# EAGLE schematic PMTHead (EAGLE 7.7.0)

## Sheet 1 of 4: PIC Processor
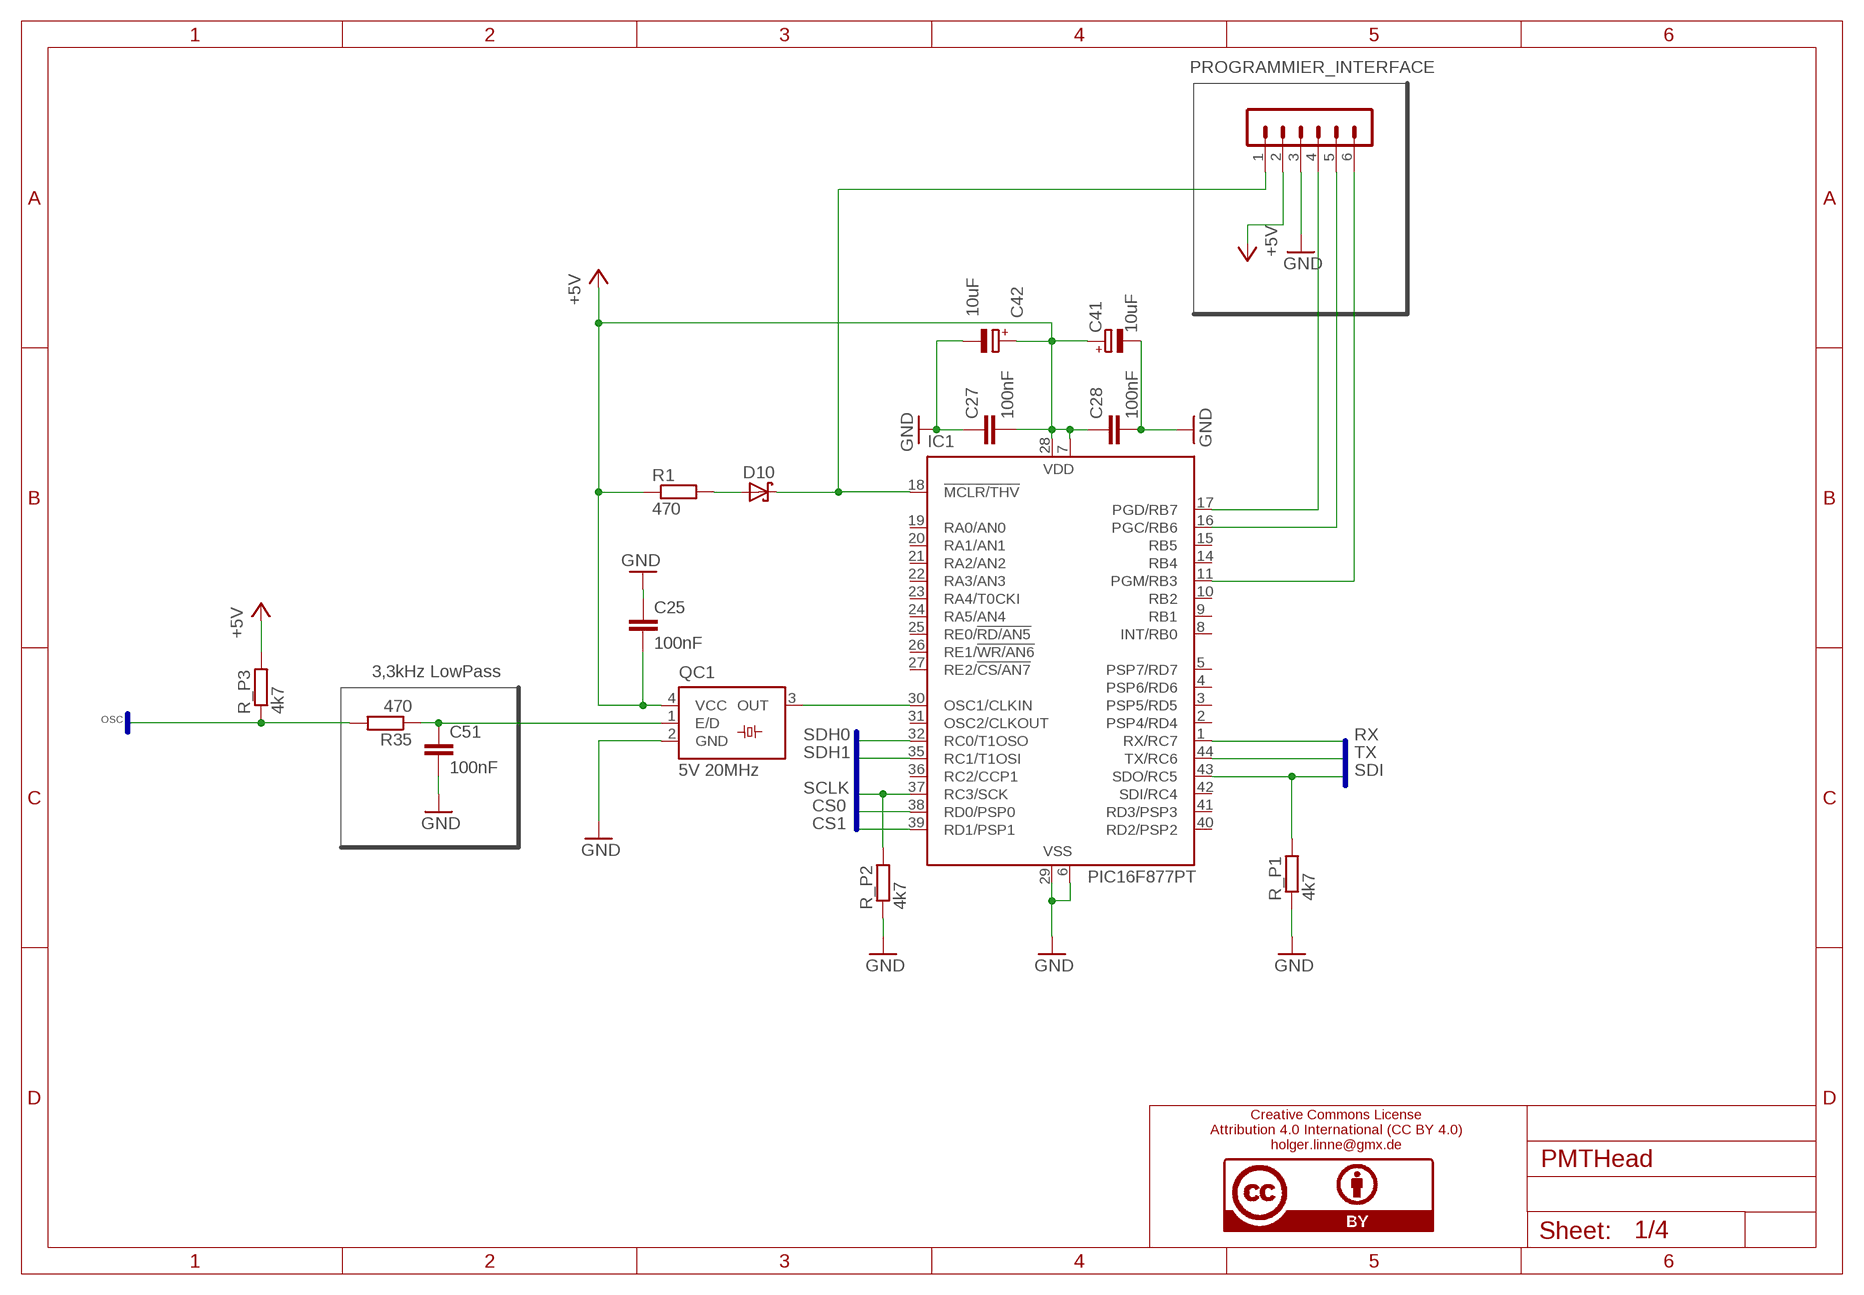
[diagram p0: schematic, sheet 1]

### Parts
C25  100nF  C-EUC0805  [C0805]
C27  100nF  C-EUC0805  [C0805]
C28  100nF  C-EUC0805  [C0805]
C41  10uF  CPOL-EUC/6032-28R  [C/6032-28R]
C42  10uF  CPOL-EUC/6032-28R  [C/6032-28R]
C51  100nF  C-EUC0805  [C0805]
D10  DIODE_BAT750  [SOT23]
IC1  PIC16F877PT  [TQFP44]
PROGRAMMIER_INTERFACE  MA06-1  [MA06-1]
QC1  5V 20MHz  SM77H  [SM77H]
R1  470  R-EU_R0805  [R0805]
R35  470  R-EU_R0805  [R0805]
R_P1  4k7  R-EU_R0805  [R0805]
R_P2  4k7  R-EU_R0805  [R0805]
R_P3  4k7  R-EU_R0805  [R0805]

### Nets
+5V: C25.2 C27.2 C28.1 C41.+ C42.+ IC1.7(VDD) IC1.28(VDD) PROGRAMMIER_INTERFACE.2 QC1.4(VCC) R1.1 R_P3.2 ; also sheet 2,4
CS0: IC1.38(RD0/PSP0) ; also sheet 2
CS1: IC1.39(RD1/PSP1) ; also sheet 2
GND: C25.1 C27.1 C28.2 C41.- C42.- C51.2 IC1.6(VSS) IC1.29(VSS) PROGRAMMIER_INTERFACE.3 QC1.2(GND) R_P1.1 R_P2.1 ; also sheet 2,3,4
N$4: IC1.11(PGM/RB3) PROGRAMMIER_INTERFACE.6
N$5: IC1.16(PGC/RB6) PROGRAMMIER_INTERFACE.5
N$6: IC1.17(PGD/RB7) PROGRAMMIER_INTERFACE.4
N$7: D10.3(C) IC1.18(!MCLR/THV) PROGRAMMIER_INTERFACE.1
N$12: D10.1(A) R1.2
N$29: C51.1 QC1.1(E/D) R35.1
OSC: R35.2 R_P3.1 ; also sheet 3
OSC_OUT: IC1.30(OSC1/CLKIN) QC1.3(OUT)
RX: IC1.1(RX/RC7) ; also sheet 3
SCLK: IC1.37(RC3/SCK) R_P2.2 ; also sheet 2
SDH0: IC1.32(RC0/T1OSO) ; also sheet 2
SDH1: IC1.35(RC1/T1OSI) ; also sheet 2
SDI: IC1.43(SDO/RC5) R_P1.2 ; also sheet 2
TX: IC1.44(TX/RC6) ; also sheet 3
Unconnected: IC1.2(PSP4/RD4) IC1.3(PSP5/RD5) IC1.4(PSP6/RD6) IC1.5(PSP7/RD7) IC1.8(INT/RB0) IC1.9(RB1) IC1.10(RB2) IC1.14(RB4) IC1.15(RB5) IC1.19(RA0/AN0) IC1.20(RA1/AN1) IC1.21(RA2/AN2) IC1.22(RA3/AN3) IC1.23(RA4/T0CKI) IC1.24(RA5/AN4) IC1.25(RE0/!RD/AN5) IC1.26(RE1/!WR/AN6) IC1.27(RE2/!CS/AN7) IC1.31(OSC2/CLKOUT) IC1.36(RC2/CCP1) IC1.40(RD2/PSP2) IC1.41(RD3/PSP3) IC1.42(SDI/RC4)

### Buses
TX,RX,OSC,SDI,SCLK,CS0,CS1,SDH0,SDH1

### Notes on the sheet
- 3,3kHz LowPass
- Creative Commons License
  Attribution 4.0 International (CC BY 4.0)
  holger.linne@gmx.de
- /Users/hll/bypig.bmp

## Sheet 2 of 4: Control PWR
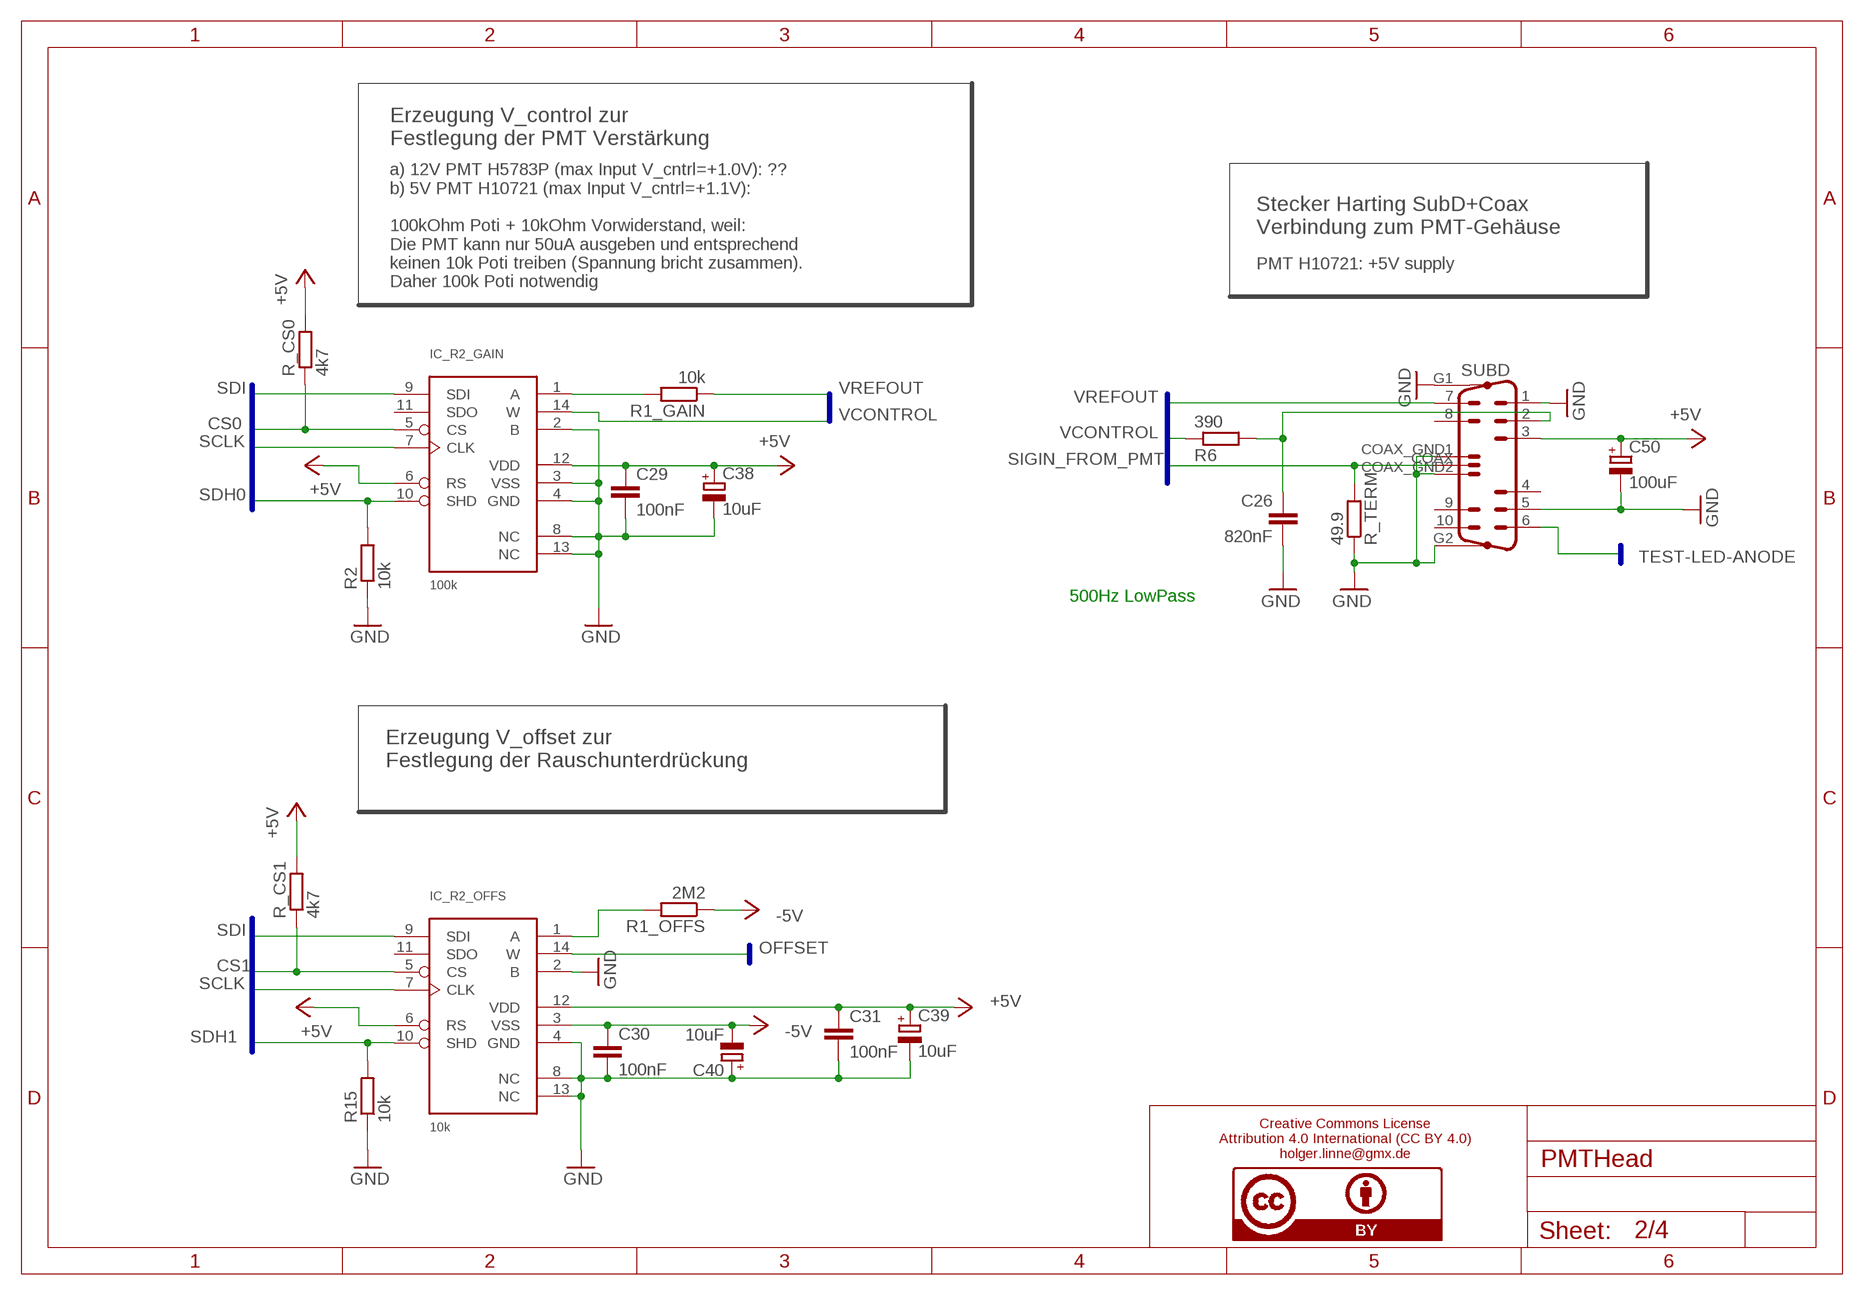
[diagram p1: schematic, sheet 2]

### Parts
C26  820nF  C-EUC1206  [C1206]
C29  100nF  C-EUC0805  [C0805]
C30  100nF  C-EUC0805  [C0805]
C31  100nF  C-EUC0805  [C0805]
C38  10uF  CPOL-EUC/6032-28R  [C/6032-28R]
C39  10uF  CPOL-EUC/6032-28R  [C/6032-28R]
C40  10uF  CPOL-EUC/6032-28R  [C/6032-28R]
C50  100uF  CPOL-EUD/7343-31R  [D/7343-31R]
IC_R2_GAIN  100k  AD7376  [TSSOP14]
IC_R2_OFFS  10k  AD7376  [TSSOP14]
R1_GAIN  10k  R-EU_R0805  [R0805]
R1_OFFS  2M2  R-EU_R0805  [R0805]
R2  10k  R-EU_R0805  [R0805]
R6  390  R-EU_R0805  [R0805]
R15  10k  R-EU_R0805  [R0805]
R_CS0  4k7  R-EU_R0805  [R0805]
R_CS1  4k7  R-EU_R0805  [R0805]
R_TERM  49.9  R-EU_R0805  [R0805]
SUBD  M15HP  [M15HP]

### Nets
+5V: C29.1 C31.1 C38.+ C39.+ C50.+ IC_R2_GAIN.6(RS) IC_R2_GAIN.12(VDD) IC_R2_OFFS.6(RS) IC_R2_OFFS.12(VDD) R_CS0.2 R_CS1.2 SUBD.3 ; also sheet 1,4
-5V: C30.1 C40.- IC_R2_OFFS.3(VSS) R1_OFFS.1 ; also sheet 4
CS0: IC_R2_GAIN.5(CS) R_CS0.1 ; also sheet 1
CS1: IC_R2_OFFS.5(CS) R_CS1.1 ; also sheet 1
GND: C26.2 C29.2 C30.2 C31.2 C38.- C39.- C40.+ C50.- IC_R2_GAIN.2(B) IC_R2_GAIN.3(VSS) IC_R2_GAIN.4(GND) IC_R2_GAIN.8(NC) IC_R2_GAIN.13(NC) IC_R2_OFFS.2(B) IC_R2_OFFS.4(GND) IC_R2_OFFS.8(NC) IC_R2_OFFS.13(NC) R2.1 R15.1 R_TERM.1 SUBD.1 SUBD.5 SUBD.COAX_GND1 SUBD.COAX_GND2 SUBD.G1 SUBD.G2 ; also sheet 1,3,4
N$11: IC_R2_GAIN.1(A) R1_GAIN.2
N$20: IC_R2_OFFS.1(A) R1_OFFS.2
N$24: C26.1 R6.2 SUBD.2
OFFSET: IC_R2_OFFS.14(W) ; also sheet 3
SCLK: IC_R2_GAIN.7(CLK) IC_R2_OFFS.7(CLK) ; also sheet 1
SDH0: IC_R2_GAIN.10(SHD) R2.2 ; also sheet 1
SDH1: IC_R2_OFFS.10(SHD) R15.2 ; also sheet 1
SDI: IC_R2_GAIN.9(SDI) IC_R2_OFFS.9(SDI) ; also sheet 1
SIGIN_FROM_PMT: R_TERM.2 SUBD.COAX ; also sheet 3
TEST-LED-ANODE: SUBD.6 ; also sheet 3
VCONTROL: IC_R2_GAIN.14(W) R6.1
VREFOUT: R1_GAIN.1 SUBD.7
Unconnected: IC_R2_GAIN.11(SDO) IC_R2_OFFS.11(SDO) SUBD.4 SUBD.8 SUBD.9 SUBD.10

### Buses
SIGIN_FROM_PMT,VREFOUT,VCONTROL,OFFSET,TEST-LED-ANODE,5V,GND
TX,RX,OSC,SDI,SCLK,CS0,CS1,SDH0,SDH1

### Notes on the sheet
- Erzeugung V_control zur
  Festlegung der PMT Verstärkung
- Stecker Harting SubD+Coax
  Verbindung zum PMT-Gehäuse
- PMT H10721: +5V supply
- a) 12V PMT H5783P (max Input V_cntrl=+1.0V): ??
  b) 5V PMT H10721 (max Input V_cntrl=+1.1V):
  
  100kOhm Poti + 10kOhm Vorwiderstand, weil: 
  Die PMT kann nur 50uA ausgeben und entsprechend
  keinen 10k Poti treiben (Spannung bricht zusammen).
  Daher 100k Poti notwendig
- 500Hz LowPass
- Erzeugung V_offset zur
  Festlegung der Rauschunterdrückung
- Creative Commons License
  Attribution 4.0 International (CC BY 4.0)
  holger.linne@gmx.de
- /Users/hll/bypig.bmp

## Sheet 3 of 4: A/D conversion and system connection
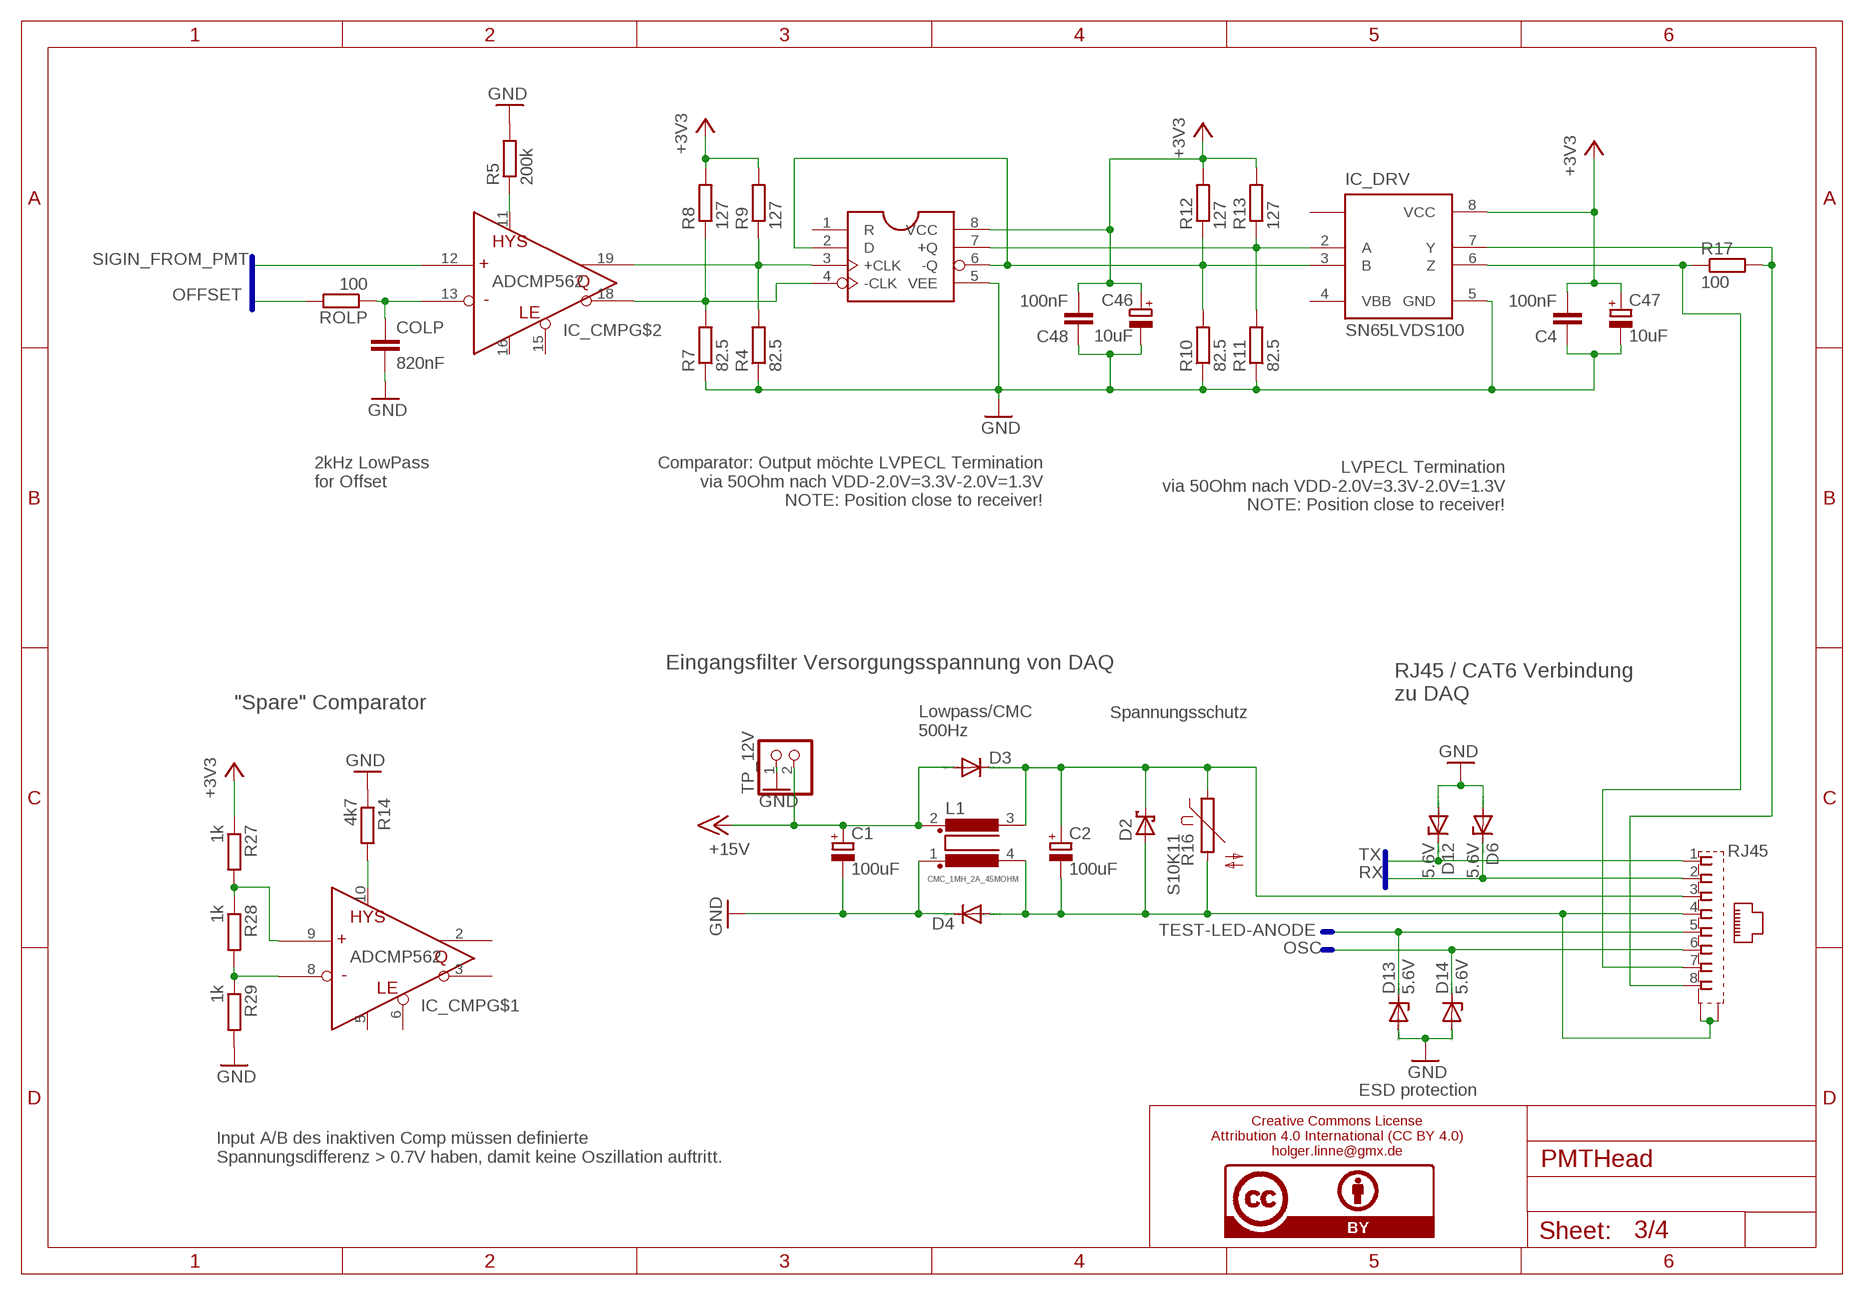
[diagram p2: schematic, sheet 3]

### Parts
C1  100uF  CPOL-EUD/7343-31R  [D/7343-31R]
C2  100uF  CPOL-EUD/7343-31R  [D/7343-31R]
C4  100nF  C-EUC0805  [C0805]
C46  10uF  CPOL-EUC/6032-28R  [C/6032-28R]
C47  10uF  CPOL-EUC/6032-28R  [C/6032-28R]
C48  100nF  C-EUC0805  [C0805]
COLP  820nF  C-EUC1206  [C1206]
D2  SCHOTTKY-DIODESMC  [SMC]
D3  DIODE-SOD80C  [SOD80C]
D4  DIODE-SOD80C  [SOD80C]
D6  5.6V  ZENER-DIODEMINIMELF  [MINIMELF]
D12  5.6V  ZENER-DIODEMINIMELF  [MINIMELF]
D13  5.6V  ZENER-DIODEMINIMELF  [MINIMELF]
D14  5.6V  ZENER-DIODEMINIMELF  [MINIMELF]
IC_CMP  ADCMP562  [QSOP20]
IC_DRV  SN65LVDS100  SN65LVDS100D  [SOP08@1]
IC_FLIP  MC100LVEL51  [SOP08@1]
L1  CMC_1MH_2A_45MOHM  [82721K]
R4  82.5  R-EU_R0805  [R0805]
R5  200k  R-EU_R0805  [R0805]
R7  82.5  R-EU_R0805  [R0805]
R8  127  R-EU_R0805  [R0805]
R9  127  R-EU_R0805  [R0805]
R10  82.5  R-EU_R0805  [R0805]
R11  82.5  R-EU_R0805  [R0805]
R12  127  R-EU_R0805  [R0805]
R13  127  R-EU_R0805  [R0805]
R14  4k7  R-EU_R0805  [R0805]
R16  S10K11  [S10K11]
R17  100  R-EU_R0805  [R0805]
R27  1k  R-EU_M0805  [M0805]
R28  1k  R-EU_M0805  [M0805]
R29  1k  R-EU_M0805  [M0805]
RJ45  CAT6  [CAT6]
ROLP  100  R-EU_R0805  [R0805]
TP_12V  PINHD-1X2  [1X02]

### Nets
12V_VON_DAQ: C2.+ D2.C D3.C L1.3 R16.1 RJ45.3
+3V3: C4.2 C46.+ C47.+ C48.2 IC_DRV.8(VCC) IC_FLIP.8(VCC) R8.2 R9.2 R12.2 R13.2 R27.1 ; also sheet 4
+15V: C1.+ D3.A L1.2 TP_12V.2 ; also sheet 4
CMP_OUT1: IC_CMP.19(+OUT) IC_FLIP.3(+CLK) R4.2 R9.1
CMP_OUT2: IC_CMP.18(-OUT) IC_FLIP.4(-CLK) R7.2 R8.1
DRIVER_OUT1: IC_DRV.7(Y) R17.2 RJ45.8
DRIVER_OUT2: IC_DRV.6(Z) R17.1 RJ45.7
FLIPFLOP_OUT1: IC_DRV.3(B) IC_FLIP.2(D) IC_FLIP.6(-Q) R10.2 R12.1
FLIPFLOP_OUT2: IC_DRV.2(A) IC_FLIP.7(+Q) R11.2 R13.1
GND: C1.- C4.1 C46.- C47.- C48.1 COLP.2 D4.C D6.A D12.A D13.A D14.A IC_DRV.5(GND) IC_FLIP.5(VEE) L1.1 R4.1 R5.2 R7.1 R10.1 R11.1 R14.1 R29.2 TP_12V.1 ; also sheet 1,2,4
GND_VON_DAQ: C2.- D2.A D4.A L1.4 R16.2 RJ45.4 RJ45.P$1(S1) RJ45.P$2(S2)
N$18: IC_CMP.11(HYS) R5.1
N$23: COLP.1 IC_CMP.13(-IN) ROLP.1
N$25: IC_CMP.10(HYS) R14.2
N$26: IC_CMP.9(+IN) R27.2 R28.1
N$27: IC_CMP.8(-IN) R28.2 R29.1
OFFSET: ROLP.2 ; also sheet 2
OSC: D14.C RJ45.6 ; also sheet 1
RX: D6.C RJ45.2 ; also sheet 1
SIGIN_FROM_PMT: IC_CMP.12(+IN) ; also sheet 2
TEST-LED-ANODE: D13.C RJ45.5 ; also sheet 2
TX: D12.C RJ45.1 ; also sheet 1
Unconnected: IC_CMP.2(+OUT) IC_CMP.3(-OUT) IC_CMP.5(+LE) IC_CMP.6(-LE) IC_CMP.15(-LE) IC_CMP.16(+LE) IC_DRV.1 IC_FLIP.1(R)

### Buses
SIGIN_FROM_PMT,VREFOUT,VCONTROL,OFFSET,TEST-LED-ANODE,5V,GND
TX,RX,OSC,SDI,SCLK,CS0,CS1,SDH0,SDH1

### Notes on the sheet
- Comparator: Output möchte LVPECL Termination
  via 50Ohm nach VDD-2.0V=3.3V-2.0V=1.3V
  NOTE: Position close to receiver!
- LVPECL Termination
  via 50Ohm nach VDD-2.0V=3.3V-2.0V=1.3V
  NOTE: Position close to receiver!
- 2kHz LowPass
  for Offset
- Eingangsfilter Versorgungsspannung von DAQ
- RJ45 / CAT6 Verbindung
  zu DAQ
- "Spare" Comparator
- Spannungsschutz
- Lowpass/CMC
  500Hz
- ESD protection
- Creative Commons License
  Attribution 4.0 International (CC BY 4.0)
  holger.linne@gmx.de
- Input A/B des inaktiven Comp müssen definierte 
  Spannungsdifferenz > 0.7V haben, damit keine Oszillation auftritt.
- /Users/hll/bypig.bmp

## Sheet 4 of 4: Powersupplies
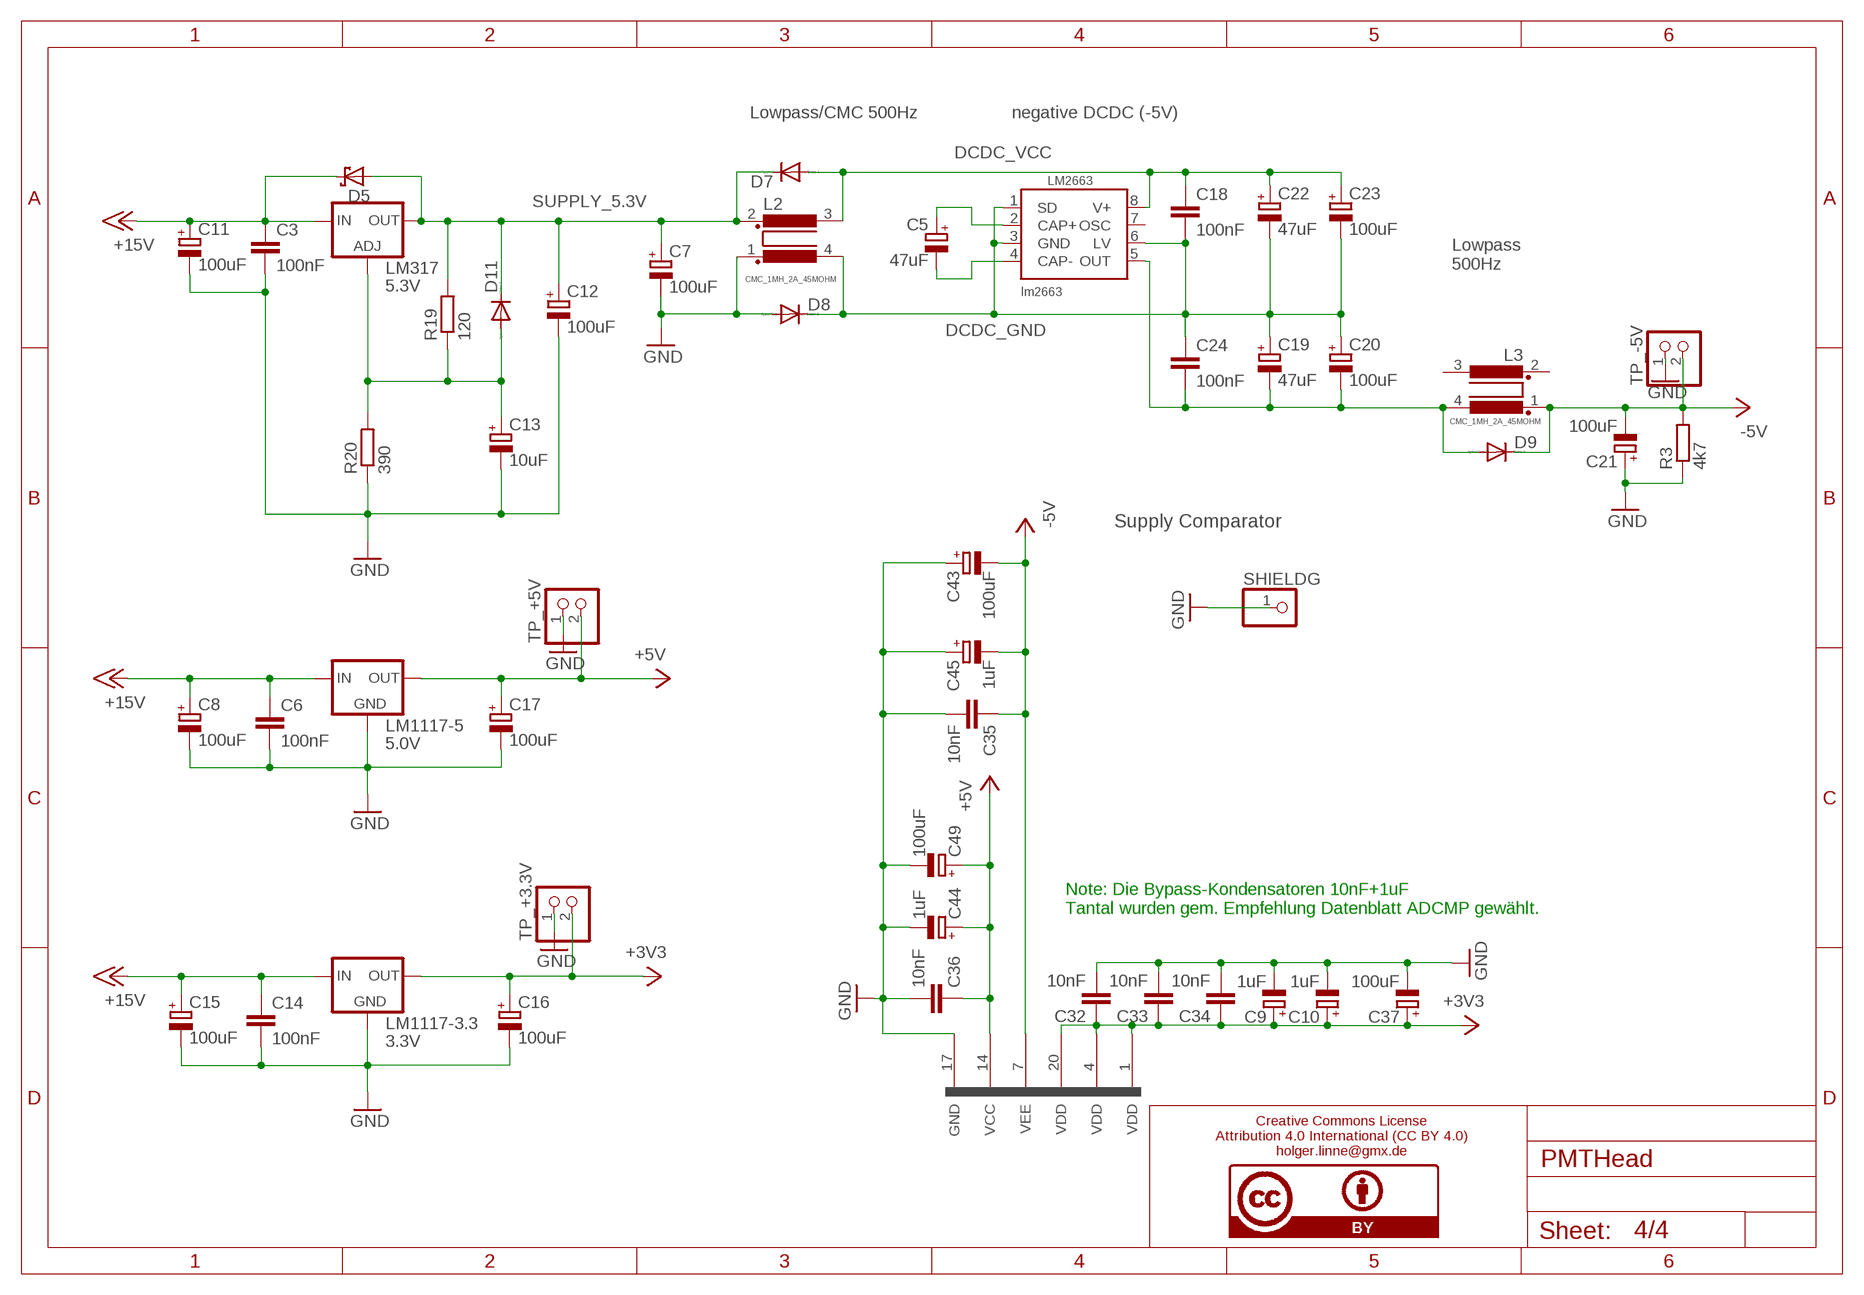
[diagram p3: schematic, sheet 4]

### Parts
C3  100nF  C-EUC0805  [C0805]
C5  47uF  CPOL-EUD/7343-31R  [D/7343-31R]
C6  100nF  C-EUC0805  [C0805]
C7  100uF  CPOL-EUD/7343-31R  [D/7343-31R]
C8  100uF  CPOL-EUD/7343-31R  [D/7343-31R]
C9  1uF  CPOL-EUA/3216-18W  [A/3216-18W]
C10  1uF  CPOL-EUA/3216-18W  [A/3216-18W]
C11  100uF  CPOL-EUD/7343-31R  [D/7343-31R]
C12  100uF  CPOL-EUD/7343-31R  [D/7343-31R]
C13  10uF  CPOL-EUC/6032-28R  [C/6032-28R]
C14  100nF  C-EUC0805  [C0805]
C15  100uF  CPOL-EUD/7343-31R  [D/7343-31R]
C16  100uF  CPOL-EUD/7343-31R  [D/7343-31R]
C17  100uF  CPOL-EUD/7343-31R  [D/7343-31R]
C18  100nF  C-EUC0805  [C0805]
C19  47uF  CPOL-EUD/7343-31R  [D/7343-31R]
C20  100uF  CPOL-EUD/7343-31R  [D/7343-31R]
C21  100uF  CPOL-EUD/7343-31R  [D/7343-31R]
C22  47uF  CPOL-EUD/7343-31R  [D/7343-31R]
C23  100uF  CPOL-EUD/7343-31R  [D/7343-31R]
C24  100nF  C-EUC0805  [C0805]
C32  10nF  C-EUC0805  [C0805]
C33  10nF  C-EUC0805  [C0805]
C34  10nF  C-EUC0805  [C0805]
C35  10nF  C-EUC0805  [C0805]
C36  10nF  C-EUC0805  [C0805]
C37  100uF  CPOL-EUD/7343-31R  [D/7343-31R]
C43  100uF  CPOL-EUD/7343-31R  [D/7343-31R]
C44  1uF  CPOL-EUA/3216-18W  [A/3216-18W]
C45  1uF  CPOL-EUA/3216-18W  [A/3216-18W]
C49  100uF  CPOL-EUD/7343-31R  [D/7343-31R]
D5  SCHOTTKY-DIODESMD  [SMB]
D7  DIODE-SOD80C  [SOD80C]
D8  DIODE-SOD80C  [SOD80C]
D9  DIODE-SOD80C  [SOD80C]
D11  DIODE-SOD80C  [SOD80C]
L2  CMC_1MH_2A_45MOHM  [82721K]
L3  CMC_1MH_2A_45MOHM  [82721K]
LM317  5.3V  LM317TS  [317TS]
LM1117-3.3  3.3V  LM1117  [317TS]
LM1117-5  5.0V  LM1117  [317TS]
LM2663  lm2663  LM2663  [SOP08]
R3  4k7  R-EU_R0805  [R0805]
R19  120  R-EU_M0805  [M0805]
R20  390  R-EU_R0805  [R0805]
SHIELDG  PINHD-1X1  [1X01]
TP_+3.3V  PINHD-1X2  [1X02]
TP_+5V  PINHD-1X2  [1X02]
TP_-5V  PINHD-1X2  [1X02]

### Nets
+3V3: C9.+ C10.+ C16.+ C32.1 C33.1 C34.1 C37.+ IC_CMP.1(VDD) IC_CMP.4(VDD) IC_CMP.20(VDD) LM1117-3.3.2_OUT(OUT) TP_+3.3V.2 ; also sheet 3
+5V: C17.+ C36.1 C44.+ C49.+ IC_CMP.14(VCC) LM1117-5.2_OUT(OUT) TP_+5V.2 ; also sheet 1,2
+15V: C3.1 C6.1 C8.+ C11.+ C14.1 C15.+ D5.C LM317.3(IN) LM1117-3.3.3_IN(IN) LM1117-5.3_IN(IN) ; also sheet 3
-5V: C21.- C35.1 C43.- C45.- D9.C IC_CMP.7(VEE) L3.1 R3.2 TP_-5V.2 ; also sheet 2
DCDC_GND: C18.2 C19.+ C20.+ C22.- C23.- C24.1 D8.C L2.4 LM2663.1(SD) LM2663.3(GND) LM2663.6(LV)
DCDC_VCC: C18.1 C22.+ C23.+ D7.A L2.3 LM2663.8(V+)
GND: C3.2 C6.2 C7.- C8.- C9.- C10.- C11.- C12.- C13.- C14.2 C15.- C16.- C17.- C21.+ C32.2 C33.2 C34.2 C35.2 C36.2 C37.- C43.+ C44.- C45.+ C49.- D8.A IC_CMP.17(GND) L2.1 LM1117-3.3.1_GND(GND) LM1117-5.1_GND(GND) R3.1 R20.1 SHIELDG.1 TP_+3.3V.1 TP_+5V.1 TP_-5V.1 ; also sheet 1,2,3
LM317_ADJ: C13.+ D11.A LM317.1(ADJ) R19.1 R20.2
N$9: C5.+ LM2663.2(CAP+)
N$16: C5.- LM2663.4(CAP-)
N$21: C19.- C20.- C24.2 D9.A L3.4 LM2663.5(OUT)
SUPPLY_5.3V: C7.+ C12.+ D5.A D7.C D11.C L2.2 LM317.2(OUT) R19.2
Unconnected: L3.2 L3.3 LM2663.7(OSC)

### Notes on the sheet
- Lowpass/CMC 500Hz | negative DCDC (-5V)
- Lowpass
  500Hz
- Supply Comparator
- Note: Die Bypass-Kondensatoren 10nF+1uF
  Tantal wurden gem. Empfehlung Datenblatt ADCMP gewählt.
- Creative Commons License
  Attribution 4.0 International (CC BY 4.0)
  holger.linne@gmx.de
- /Users/hll/bypig.bmp

## Power pins joined to a net without a drawn wire
VBB: IC_DRV.4(VBB)

## Library data of the parts
C1 C2 C8 C11 C15 = rcl:CPOL-EU: POLARIZED CAPACITOR, European symbol; BESTELLNR: RS Artnr.801-5511; TYPE: Tantal, 25VDC
C3 C4 C6 C14 C18 C24 C25 C27-C31 C48 C51 = rcl:C-EU: CAPACITOR, European symbol; BESTELLNR: RS ArtNr. 264-4416; TYPE: 50V
C5 C19 C22 = rcl:CPOL-EU: POLARIZED CAPACITOR, European symbol; BESTELLNR: Distrelec Artnr.167-74-871; TYPE: Tantal, ESR=0.1Ohm, 20VDC
C7 C12 C16 C17 C20 C21 C23 C43 C49 C50 = rcl:CPOL-EU: POLARIZED CAPACITOR, European symbol; BESTELLNR: RS Artnr.684-3923; TYPE: Tantal, 20VDC
C9 C10 C44 C45 = rcl:CPOL-EU: POLARIZED CAPACITOR, European symbol; BESTELLNR: RS-ArtNr. 801-5491
C13 C46 = rcl:CPOL-EU: POLARIZED CAPACITOR, European symbol; BESTELLNR: RS-ArtNr. 801-5485
C26 COLP = rcl:C-EU: CAPACITOR, European symbol; BESTELLNR: RS ArtNr. 698-3664
C32-C36 = rcl:C-EU: CAPACITOR, European symbol; BESTELLNR: RS ArtNr. 790-0575; TYPE: 50V
C37 = rcl:CPOL-EU: POLARIZED CAPACITOR, European symbol; BESTELLNR: RS Artnr. 684-3923; TYPE: Tantal, 20VDC
C38 C40-C42 = rcl:CPOL-EU: POLARIZED CAPACITOR, European symbol; BESTELLNR: RS ArtNr. 801-5485
C39 = rcl:CPOL-EU: POLARIZED CAPACITOR, European symbol; BNESTELLNR: RS ArtNr. 801-5485
C47 = rcl:CPOL-EU: POLARIZED CAPACITOR, European symbol; TYPE: RS-ArtNr. 801-5485
D2 = diode:SCHOTTKY-DIODE: Schottky Diode; BESTELLNR: RS ArtNr. 751-3297; TYPE: Schottky, 30V, 5A
D3 D4 = diode:DIODE-: DIODE; BESTELLNR: RS-ArtNr. 670-8823; TYPE: 100V, 0.3A, 4pF
D5 = diode:SCHOTTKY-DIODE: Schottky Diode; BESTELLNR: RS ArtNr. 688-2252; TYPE: Schottky, 30V, 2A
D6 D12-D14 = zener-diode:ZENER-DIODE: DIODE; BESTELLNR: RS ArtNr. 710-4449; TYPE: 5.6V
D7-D9 D11 = diode:DIODE-: DIODE; BESTELLNR: RS-ArtNr. 670-8823; TYPE: Schottky 100V, 0.3A, 4pF
D10 = diode_bat750:DIODE_BAT750: Schottky Diodes 40V,750mA,V_f=490mV@750mA RS ArtNr. 751-3424; BESTELLNR: RS ArtNr. 751-3424; TYPE: Schottky, 40V, 0.49V, 750mA
IC1 = microchip:PIC16F87*: MICROCONTROLLER; MF: MICROCHIP; MPN: PIC16F877-04/PQ; OC_FARNELL: 9761411; OC_NEWARK: 23C5094
IC_CMP = fcounter:ADCMP562; BESTELLNR: RS ArtNr. 538-4971, Farnell 143-8726, Mouser 584-ADCMP562BRQZ
IC_DRV = fcounter:SN65LVDS100D; BESTELLNR: RS-ArtNr. 462-0096, Farnell 845-2393
IC_FLIP = fcounter:MC100LVEL51; BESTELLNR: Spoerle Electronic MC100LVEL51DG, DigiKey MC100LVEL51DGOS-ND
IC_R2_GAIN = fcounter:AD7376; BESTELLNR: RS ArtNr. 709-6367
IC_R2_OFFS = fcounter:AD7376; BESTELLNR: RS ArtNr. 709-6358P
L1 = CMC_1mH_2A_45mOhm_RS-489-0144:CMC_1MH_2A_45MOHM: CMC choke 1mH 0.045 Ohm RS ArtNr. 489-0144
L2 L3 = CMC_1mH_2A_45mOhm_RS-489-0144:CMC_1MH_2A_45MOHM: CMC choke 1mH 0.045 Ohm RS ArtNr. 489-0144; BESTELLNR: RS-489-0144
LM317 = v-reg:LM317TS: VOLTAGE REGULATOR; BESTELLNR: RS-ArtNr. 714-0792
LM1117-3.3 = lm1117:LM1117: VOLTAGE REGULATOR; BESTELLNR: RS-ArtNr. 535-9256; TYPE: LM1117 3.3V
LM1117-5 = lm1117:LM1117: VOLTAGE REGULATOR; BESTELLNR: RS-ArtNr. 535-9262; TYPE: LM1117 5.0V
LM2663 = fcounter:LM2663; BESTELLNR: RS-ArtNr. 533-3967 , Farnell ArtNr. 146-9160
PROGRAMMIER_INTERFACE = con-lstb:MA06-1: PIN HEADER; OC_FARNELL: unknown; OC_NEWARK: unknown
QC1 = crystal_large_Pads_laengs:SM77H: 3.3V CMOS Clock Oscillator Source: www.pletronics.com .. sm77h%203.3v.pdf; BESTELLNR: Distrelec-ArtNr. 174-59-050
R1 R35 = rcl:R-EU_: RESISTOR, European symbol; BESTELLNR: RS-ArtNr. 740-9038
R1_GAIN R2 R15 = rcl:R-EU_: RESISTOR, European symbol; BESTELLNR: RS ArtNr. 565-948; TYPE: 0.1%, Duennschicht
R1_OFFS = rcl:R-EU_: RESISTOR, European symbol; BESTELLNR: RS ArtNr. 678-6842; TYPE: Duennschicht
R3 R14 R_CS0 R_CS1 R_P1-R_P3 = rcl:R-EU_: RESISTOR, European symbol; BESTELLNR: RS-Artnr. 666-2575; TYPE: Duennschicht
R4 = rcl:R-EU_: RESISTOR, European symbol; BESTELNR: RS ArtNr. 708-9252; TYPE: 0.1%, Metallfolie
R5 = rcl:R-EU_: RESISTOR, European symbol; BESTELLNR: RS ArtNr. 678-6826; TYPE: Duennfilm
R6 = rcl:R-EU_: RESISTOR, European symbol; BESTELLNR: RS-ArtNr. 565-875; TYPE: 0.1, 0.125W, Duennschicht
R7 R10 R11 = rcl:R-EU_: RESISTOR, European symbol; BESTELLNR: RS ArtNr. 708-9252; TYPE: 0.1%, Metallfolie
R8 R9 R12 R13 = rcl:R-EU_: RESISTOR, European symbol; BESTELLNR: RS ArtNr. 708-9306; TYPE: 0.1%, Metallfolie
R16 = varistor:S10K11: VARISTOR; BESTELLNR: RS 289-7525
R17 = rcl:R-EU_: RESISTOR, European symbol; BESTELLNR: RS-ArtNr. 566-907; TYPE: 0.1%, Duennschicht
R19 = rcl:R-EU_: RESISTOR, European symbol; BESTELLNR: RS-ArtNr. 566-840; TYPE: 0.1%, 0.125W
R20 = rcl:R-EU_: RESISTOR, European symbol; BESTELLNR: RS-ArtNr. 565-875; TYPE: 0.1%, 0.125W, Duennschicht
R27-R29 = rcl:R-EU_: RESISTOR, European symbol; BESTELLNR: RS ArtNr. 565-964; TYPE: Metallfolie
R_TERM = rcl:R-EU_: RESISTOR, European symbol; BESTELLNR: RS ArtNr. 708-9182; TYPE: 0.1%, Metallfolie
RJ45 = fcounter:CAT6; BESTELLNR: Conrad Electronic ArtNr. 741529 - 62
ROLP = rcl:R-EU_: RESISTOR, European symbol; BESTELLNR: RS-ArtNr. 566-907; TYPE: 0.1 %, Duennschicht
SHIELDG = pinhead:PINHD-1X1: PIN HEADER
SUBD = subd-15_mixed-signal_harting_gewinkelt:M15HP: SUB-D Harting ArtNr. TB 09 60 200 9296 10x Signal + 1xCoax 50 Ohm; BESTELLNR: Distrelec 14417297 + 14417306; INFO: Gegenstueck fuer PMT Gehaeuse: Distrelec 14417260 + 14417245; OC_FARNELL: unknown; OC_NEWARK: unknown
TP_12V TP_+3.3V TP_+5V TP_-5V = pinhead:PINHD-1X2: PIN HEADER

## Net classes
0 default: width 0.2 mm, clearance 0.205 mm
1 power: width 1.4 mm, clearance 0.2 mm
2 hpower: width 3 mm, clearance 0.2 mm